# Altium project Stabilizer.PrjPCB (part 1 of 5)
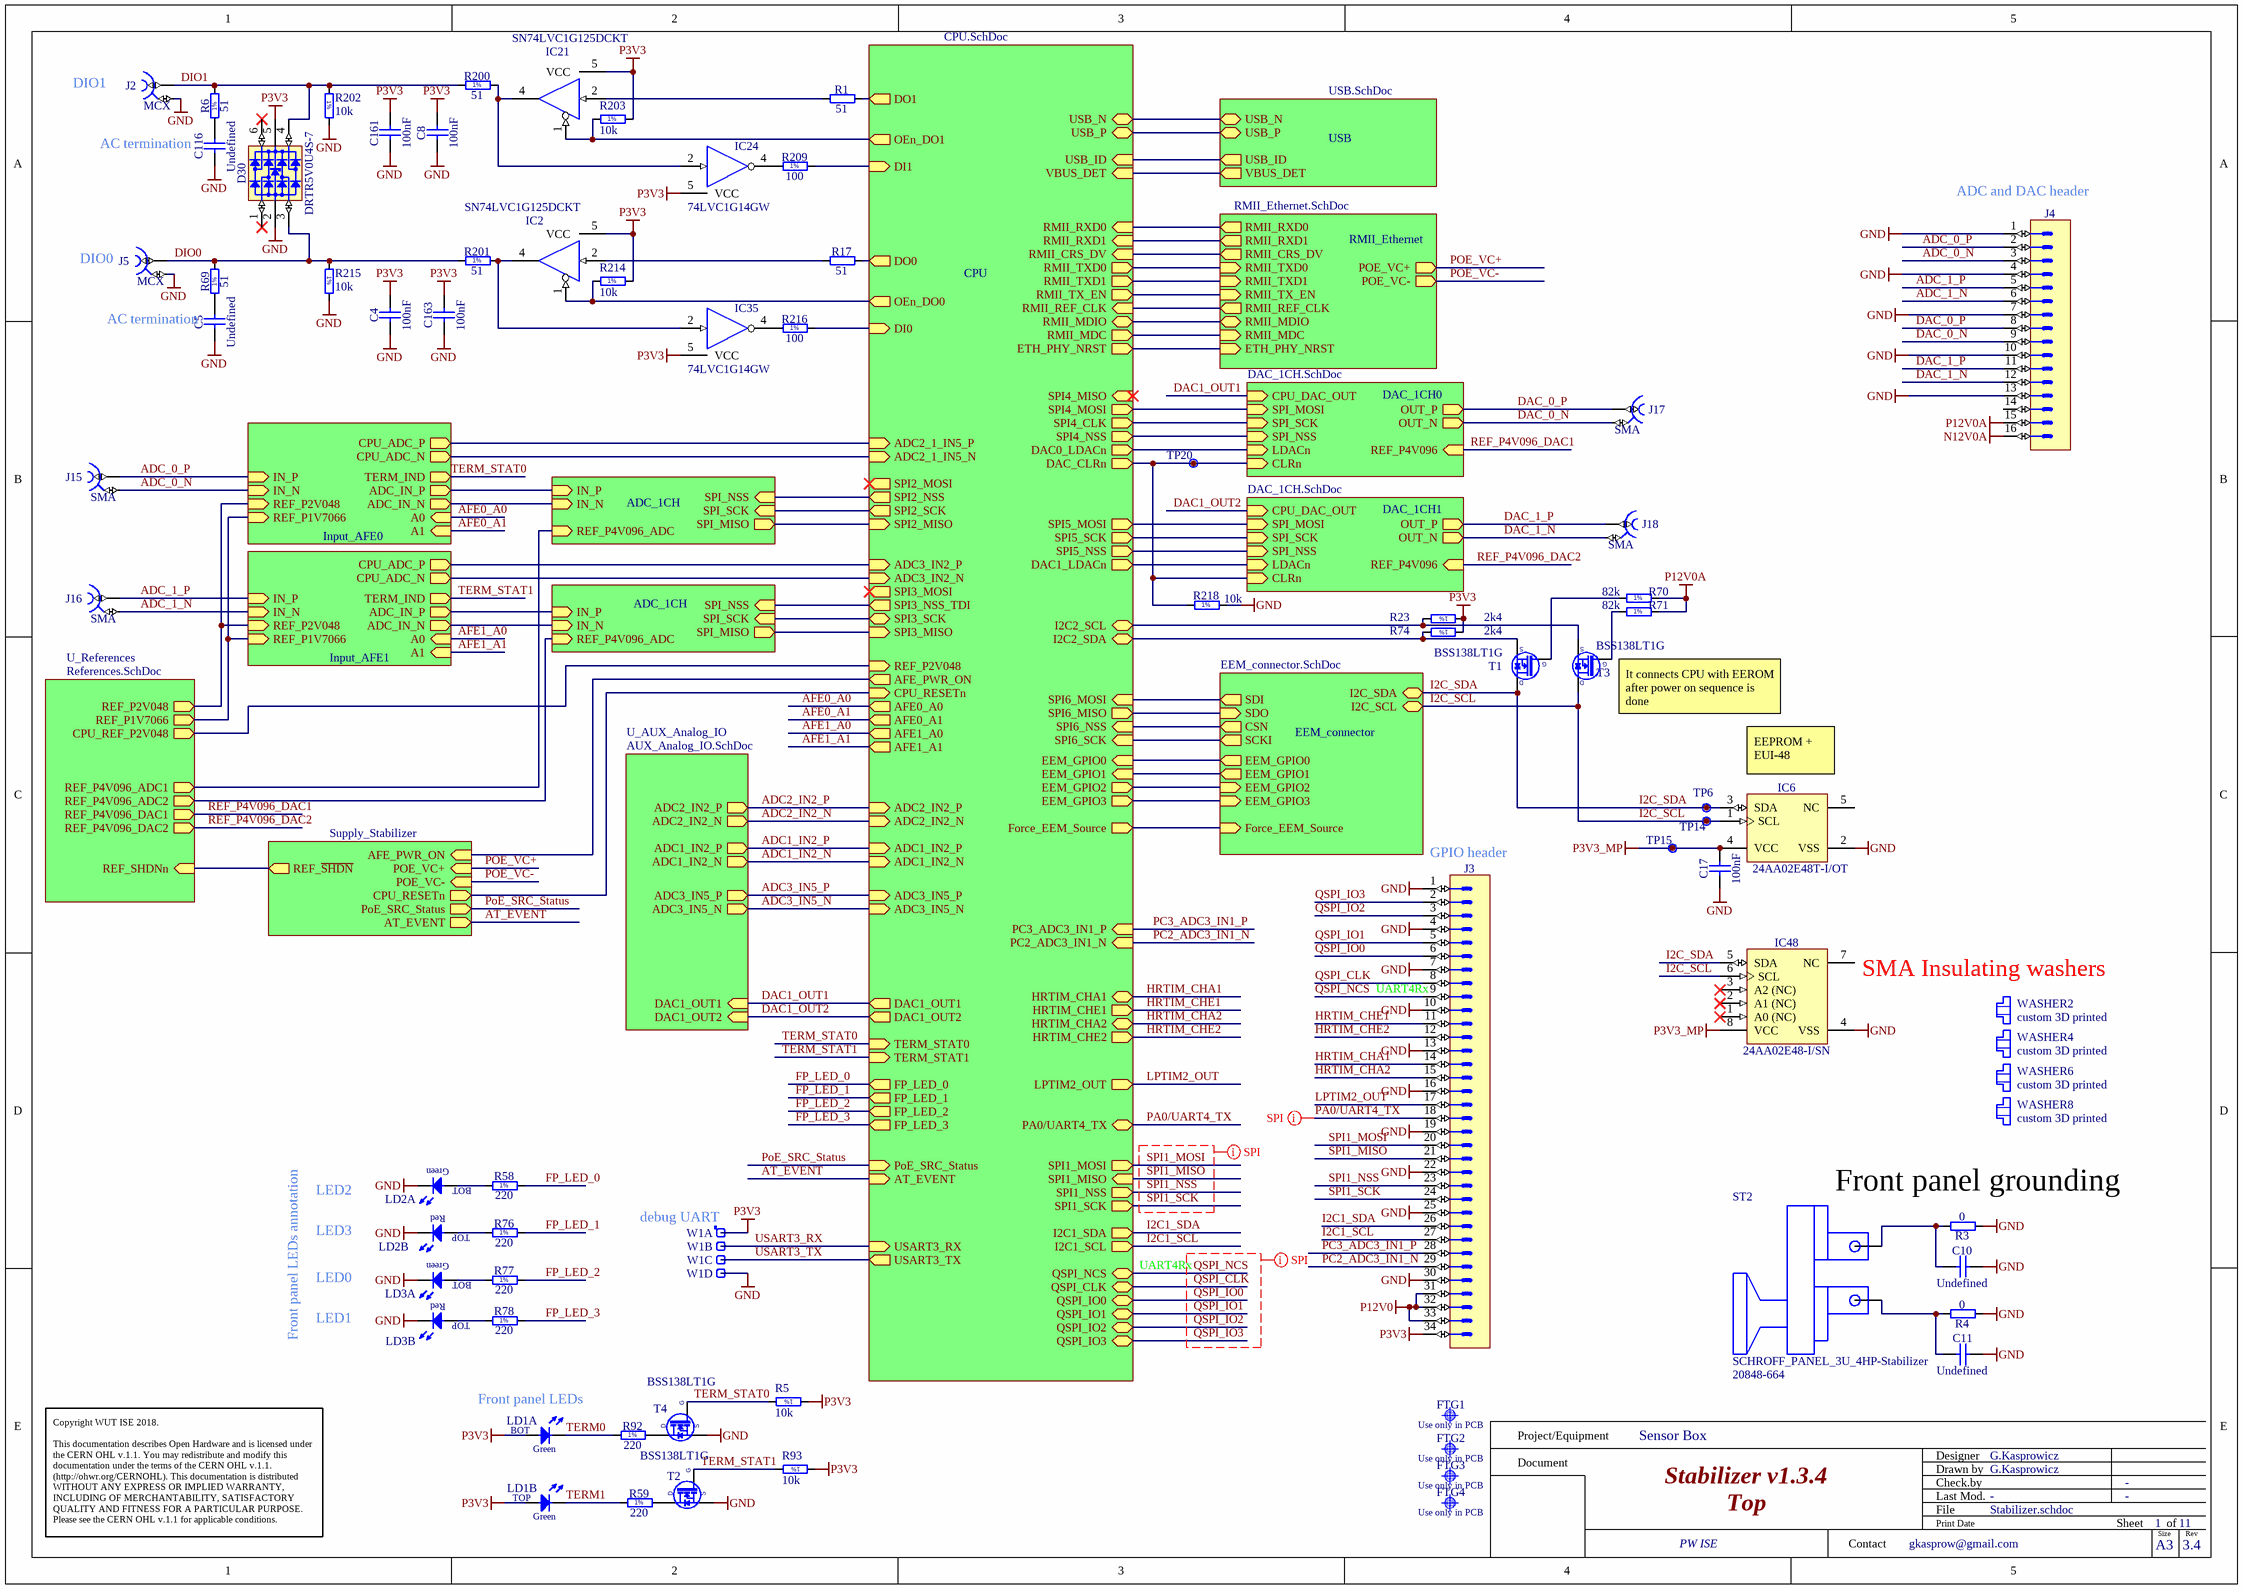
[diagram p0: Stabilizer.schdoc]
P_version: 1.3.4
11 sheets, 687 parts. Net scope: hierarchical (ports join the sheet entries above them; power ports are global).
Board files: Stabilizer.PCBDOC, Panel_Stabilizer.PcbDoc
Sheets:
  Stabilizer.schdoc
    Supply_Stabilizer = Supply_Stabilizer.SchDoc
    RMII_Ethernet = RMII_Ethernet.SchDoc
    USB = USB.SchDoc
    CPU = CPU.SchDoc
    Input_AFE0 = Input_AFE.SchDoc
    ADC_1CH = ADC_1CH.SchDoc
    DAC_1CH0 = DAC_1CH.SchDoc
    ADC_1CH = ADC_1CH.SchDoc
    Input_AFE1 = Input_AFE.SchDoc
    U_References = References.SchDoc
    DAC_1CH1 = DAC_1CH.SchDoc
    EEM_connector = EEM_connector.SchDoc
    U_AUX_Analog_IO = AUX_Analog_IO.SchDoc

## Sheet Stabilizer.schdoc: Stabilizer v1.3.4
size 420 x 297 mm; EDA_Number: ARTIQ; Projet: Stabilizer; Author: G.Kasprowicz; CompanyName: WUT ISE; DrawnBy: G.Kasprowicz; Organization: WUT ISE; Address1: PW ISE; Address2: Nowowiejska 15/19 00-665 Warsaw; Address3: gkasprow@gmail.com; DocumentNumber: 1; Revision: 3.4; SheetNumber: 1; SheetTotal: 11; ModifiedBy: -; CheckedDate: -; Title2: Top; DivGrp: WUT ISE; Designer: G.Kasprowicz; ModifiedDate: -; ProjectName: Sensor Box

### Parts
C4  100nF  [CAPC1005X55N]
C5  Undefined  [CAPC1608X90N]
C8  100nF  [CAPC1005X55N]
C10  Undefined  [CAPC2012X135N]
C11  Undefined  [CAPC2012X135N]
C17  100nF  [CAPC1005X55N]
C116  Undefined  [CAPC1608X90N]
C161  100nF  [CAPC1005X55N]
C163  100nF  [CAPC1005X55N]
D30  DRTR5V0U4S-7  [SOT65P210X110-6N]
FTG1  Use only in PCB  [FIDUCIAL_TOP_C100-200]
FTG2  Use only in PCB  [FIDUCIAL_TOP_S100-200]
FTG3  Use only in PCB  [FIDUCIAL_TOP_S100-200]
FTG4  Use only in PCB  [FIDUCIAL_TOP_S100-200]
IC2  SN74LVC1G125DCKT  [SOT65P210X110-5N]
IC6  24AA02E48T-I/OT  [SOT95P280X145-5N]
IC21  SN74LVC1G125DCKT  [SOT65P210X110-5N]
IC24  74LVC1G14GW  [SOT65P212X110-5N]
IC35  74LVC1G14GW  [SOT65P212X110-5N]
IC48  24AA02E48-I/SN  [SOIC127P600X175-8N]
J2  MCX  [AMPHENOL_919-383J-51A]
J3  Use original!  [3M_N2534-6002RB]  (value not drawn)
J4  Use original!  [3M_N2516-6002RB]  (value not drawn)
J5  MCX  [AMPHENOL_919-383J-51A]
J15  SMA  [DELOCK_65848]
J16  SMA  [DELOCK_65848]
J17  SMA  [DELOCK_65848]
J18  SMA  [DELOCK_65848]
LD1  Green/Green  [LED_DIALIGHT_571-0122F]  (value not drawn)  (parts A,B of 2)
LD2  Red/Green  [LED_DIALIGHT_571-0112F]  (value not drawn)  (parts A,B of 2)
LD3  Red/Green  [LED_DIALIGHT_571-0112F]  (value not drawn)  (parts A,B of 2)
R1  51  [RESC1005X40N]
R3  0  [RESC1608X55N]
R4  0  [RESC1608X55N]
R5  10k  [RESC1005X40N]
R6  51  [RESC1005X40N]
R17  51  [RESC1005X40N]
R23  2k4  [RESC1005X40N]
R58  220  [RESC1608X55N]
R59  220  [RESC1608X55N]
R69  51  [RESC1005X40N]
R70  82k  [RESC1608X55N]
R71  82k  [RESC1608X55N]
R74  2k4  [RESC1005X40N]
R76  220  [RESC1608X55N]
R77  220  [RESC1608X55N]
R78  220  [RESC1608X55N]
R92  220  [RESC1608X55N]
R93  10k  [RESC1005X40N]
R200  51  [RESC1005X40N]
R201  51  [RESC1005X40N]
R202  10k  [RESC1005X40N]
R203  10k  [RESC1005X40N]
R209  100  [RESC1005X40N]
R214  10k  [RESC1005X40N]
R215  10k  [RESC1005X40N]
R216  100  [RESC1005X40N]
R218  10k  [RESC1005X40N]
ST2  SCHROFF_PANEL_3U_4HP-Stabilizer  Manufacturer Part Number 2: 20848-664  [SCHROFF_PANEL_3HP_4U - Stabilizer]
T1  BSS138LT1G  [SOT95P240X110-3N]
T2  BSS138LT1G  [SOT95P240X110-3N]
T3  BSS138LT1G  [SOT95P240X110-3N]
T4  BSS138LT1G  [SOT95P240X110-3N]
TP6  Test Point  [TPS127]  (value not drawn)
TP14  Test Point  [TPS127]  (value not drawn)
TP15  Test Point  [TPS127]  (value not drawn)
TP20  Test Point  [TPS127]  (value not drawn)
W1  Header 4  [SAMTEC_HTSW-104-23-L-S]  (value not drawn)  (parts A,B,C,D of 4)
WASHER2  custom 3D printed  [Keystone_7687]
WASHER4  custom 3D printed  [Keystone_7687]
WASHER6  custom 3D printed  [Keystone_7687]
WASHER8  custom 3D printed  [Keystone_7687]

### Sub-sheets
ADC_1CH = ADC_1CH.SchDoc: IN_P (in), IN_N (in), SPI_NSS (in), SPI_SCK (in), SPI_MISO (out), REF_P4V096_ADC (in)
ADC_1CH = ADC_1CH.SchDoc: IN_P (in), IN_N (in), SPI_NSS (in), SPI_SCK (in), SPI_MISO (out), REF_P4V096_ADC (in)
CPU = CPU.SchDoc: USB_N (bidir), USB_P (bidir), USB_ID (in), RMII_TXD0 (out), RMII_TX_EN (out), RMII_RXD0 (in), RMII_REF_CLK (in), RMII_CRS_DV (in), RMII_MDC (out), RMII_MDIO (bidir), RMII_TXD1 (out), RMII_RXD1 (in), DAC1_OUT1 (out), ADC1_IN2_P (in), I2C2_SDA (bidir), SPI6_MOSI (in), I2C2_SCL (bidir), DAC1_OUT2 (out), ADC3_IN5_N (in), ADC3_IN5_P (in), SPI6_MISO (out), SPI6_NSS (in), ADC1_IN2_N (in), PC3_ADC3_IN1_P (in), PC2_ADC3_IN1_N (in), SPI6_SCK (in), AFE0_A0 (out), AFE0_A1 (out), AFE1_A0 (out), AFE1_A1 (out), DI0 (in), DI1 (in), DAC0_LDACn (out), DAC1_LDACn (out), DAC_CLRn (out), CPU_RESETn (in), EEM_GPIO0 (in), EEM_GPIO1 (in), EEM_GPIO2 (out), EEM_GPIO3 (out), I2C1_SDA (out), I2C1_SCL (out), PA0/UART4_TX (bidir), HRTIM_CHE1 (out), HRTIM_CHA2 (bidir), HRTIM_CHA1 (bidir), LPTIM2_OUT (out), HRTIM_CHE2 (out), TERM_STAT0 (in), TERM_STAT1 (in), REF_P2V048 (in), FP_LED_0 (out), FP_LED_1 (out), FP_LED_2 (out), FP_LED_3 (out), ADC2_1_IN5_P (in), ADC2_1_IN5_N (in), ADC3_IN2_N (in), ADC3_IN2_P (in), ADC2_IN2_P (in), ADC2_IN2_N (in), AT_EVENT (in), ETH_PHY_NRST (out), SPI3_SCK (bidir), SPI3_MOSI (out), SPI3_MISO (in), SPI3_NSS_TDI (out), SPI2_MOSI (out), SPI2_NSS (out), SPI2_SCK (out), SPI2_MISO (in), SPI1_SCK (out), SPI1_NSS (out), SPI1_MISO (in), SPI1_MOSI (out), SPI4_MOSI (out), SPI4_NSS (out), SPI4_CLK (out), SPI4_MISO (in), SPI5_NSS (out), SPI5_SCK (out), SPI5_MOSI (out), QSPI_IO0 (bidir), QSPI_NCS (bidir), QSPI_IO3 (bidir), QSPI_CLK (bidir), QSPI_IO1 (bidir), QSPI_IO2 (bidir), PoE_SRC_Status (in), Force_EEM_Source (out), VBUS_DET (in), DO0 (out), DO1 (out), OEn_DO0 (out), OEn_DO1 (out), USART3_TX (out), USART3_RX (in), AFE_PWR_ON (out)
DAC_1CH0 = DAC_1CH.SchDoc: SPI_NSS (in), SPI_SCK (in), SPI_MOSI (in), OUT_P (out), OUT_N (out), LDACn (in), CLRn (in), REF_P4V096 (in), CPU_DAC_OUT (in)
DAC_1CH1 = DAC_1CH.SchDoc: SPI_NSS (in), SPI_SCK (in), SPI_MOSI (in), OUT_P (out), OUT_N (out), LDACn (in), CLRn (in), REF_P4V096 (in), CPU_DAC_OUT (in)
EEM_connector = EEM_connector.SchDoc: I2C_SDA (bidir), I2C_SCL (bidir), EEM_GPIO0 (out), EEM_GPIO1 (out), EEM_GPIO2 (in), EEM_GPIO3 (in), SCKI (out), SDI (out), CSN (out), SDO (in), Force_EEM_Source (in)
Input_AFE0 = Input_AFE.SchDoc: IN_N (in), A0 (in), A1 (in), IN_P (in), TERM_IND (out), ADC_IN_P (out), ADC_IN_N (out), REF_P2V048 (in), REF_P1V7066 (in), CPU_ADC_N (out), CPU_ADC_P (out)
Input_AFE1 = Input_AFE.SchDoc: IN_N (in), A0 (in), A1 (in), IN_P (in), TERM_IND (out), ADC_IN_P (out), ADC_IN_N (out), REF_P2V048 (in), REF_P1V7066 (in), CPU_ADC_N (out), CPU_ADC_P (out)
RMII_Ethernet = RMII_Ethernet.SchDoc: RMII_TXD0 (in), RMII_TX_EN (in), RMII_RXD0 (out), RMII_REF_CLK (out), RMII_CRS_DV (out), RMII_MDC (in), RMII_MDIO (bidir), ETH_PHY_NRST (in), RMII_TXD1 (in), RMII_RXD1 (out), POE_VC+ (out), POE_VC- (out)
Supply_Stabilizer = Supply_Stabilizer.SchDoc: REF_~{SHDN} (out), POE_VC+ (in), POE_VC- (in), CPU_RESETn (out), AT_EVENT (out), PoE_SRC_Status (out), AFE_PWR_ON (in)
U_AUX_Analog_IO = AUX_Analog_IO.SchDoc: DAC1_OUT1 (in), ADC1_IN2_P (out), DAC1_OUT2 (in), ADC3_IN5_N (out), ADC3_IN5_P (out), ADC1_IN2_N (out), ADC2_IN2_P (out), ADC2_IN2_N (out)
U_References = References.SchDoc: REF_SHDNn (in), REF_P4V096_ADC2 (out), REF_P2V048 (out), REF_P1V7066 (out), REF_P4V096_DAC2 (out), REF_P4V096_DAC1 (out), CPU_REF_P2V048 (out), REF_P4V096_ADC1 (out)
USB = USB.SchDoc: VBUS_DET (out), USB_N (bidir), USB_P (bidir), USB_ID (out)

### Nets
GND: C4.1 C5.1 C8.1 C10.2 C11.2 C17.1 C116.1 C161.1 C163.1 D30.2(GND) IC2.3(GND) IC6.2(VSS) IC21.3(GND) IC24.3(GND) IC35.3(GND) IC48.4(VSS) J2.2 J3.1 J3.4 J3.7 J3.10 J3.13 J3.16 J3.19 J3.22 J3.25 J3.30 J4.1 J4.4 J4.7 J4.10 J4.13 J5.2 LD2.1(C) LD2.3(C) LD3.1(C) LD3.3(C) R3.1 R4.1 R202.2 R215.2 R218.2 T2.2(S) T4.2(S) W1.4
N12V0A: J4.16
P3V3: C4.2 C8.2 C161.2 C163.2 D30.5(VBUS) IC2.5(VCC) IC21.5(VCC) IC24.5(VCC) IC35.5(VCC) J3.34 LD1.2(A) LD1.4(A) R5.1 R23.1 R74.1 R93.1 R203.2 R214.2 W1.1
P3V3_MP: C17.2 IC6.4(VCC) IC48.8(VCC) TP15.1
P12V0: J3.31 J3.32 J3.33
P12V0A: J4.15 R70.2 R71.2
ADC1_IN2_N: sheet CPU/ADC1_IN2_N, sheet U_AUX_Analog_IO/ADC1_IN2_N
ADC1_IN2_P: sheet CPU/ADC1_IN2_P, sheet U_AUX_Analog_IO/ADC1_IN2_P
ADC2_1_IN5_N: sheet CPU/ADC2_1_IN5_N, sheet Input_AFE0/CPU_ADC_N
ADC2_1_IN5_P: sheet CPU/ADC2_1_IN5_P, sheet Input_AFE0/CPU_ADC_P
ADC2_IN2_N: sheet CPU/ADC2_IN2_N, sheet U_AUX_Analog_IO/ADC2_IN2_N
ADC2_IN2_P: sheet CPU/ADC2_IN2_P, sheet U_AUX_Analog_IO/ADC2_IN2_P
ADC3_IN2_N: sheet CPU/ADC3_IN2_N, sheet Input_AFE1/CPU_ADC_N
ADC3_IN2_P: sheet CPU/ADC3_IN2_P, sheet Input_AFE1/CPU_ADC_P
ADC3_IN5_N: sheet CPU/ADC3_IN5_N, sheet U_AUX_Analog_IO/ADC3_IN5_N
ADC3_IN5_P: sheet CPU/ADC3_IN5_P, sheet U_AUX_Analog_IO/ADC3_IN5_P
ADC_0_N: J4.3 J15.2 ; sheet Input_AFE0/IN_N
ADC_0_P: J4.2 J15.1 ; sheet Input_AFE0/IN_P
ADC_1_N: J4.6 J16.2 ; sheet Input_AFE1/IN_N
ADC_1_P: J4.5 J16.1 ; sheet Input_AFE1/IN_P
AFE0_A0: sheet CPU/AFE0_A0, sheet Input_AFE0/A0
AFE0_A1: sheet CPU/AFE0_A1, sheet Input_AFE0/A1
AFE1_A0: sheet CPU/AFE1_A0, sheet Input_AFE1/A0
AFE1_A1: sheet CPU/AFE1_A1, sheet Input_AFE1/A1
AFE_PWR_ON: sheet Supply_Stabilizer/AFE_PWR_ON, sheet CPU/AFE_PWR_ON
AT_EVENT: sheet Supply_Stabilizer/AT_EVENT, sheet CPU/AT_EVENT
CLRn: R218.1 TP20.1 ; sheet CPU/DAC_CLRn, sheet DAC_1CH0/CLRn, sheet DAC_1CH1/CLRn
CPU_REF_P2V048: sheet CPU/REF_P2V048, sheet U_References/CPU_REF_P2V048
CPU_RESETn: sheet Supply_Stabilizer/CPU_RESETn, sheet CPU/CPU_RESETn
CSN: sheet CPU/SPI6_NSS, sheet EEM_connector/CSN
DAC0_LDACn: sheet CPU/DAC0_LDACn, sheet DAC_1CH0/LDACn
DAC1_LDACn: sheet CPU/DAC1_LDACn, sheet DAC_1CH1/LDACn
DAC1_OUT1: sheet CPU/DAC1_OUT1, sheet DAC_1CH0/CPU_DAC_OUT, sheet U_AUX_Analog_IO/DAC1_OUT1
DAC1_OUT2: sheet CPU/DAC1_OUT2, sheet DAC_1CH1/CPU_DAC_OUT, sheet U_AUX_Analog_IO/DAC1_OUT2
DAC_0_N: J4.9 J17.2 ; sheet DAC_1CH0/OUT_N
DAC_0_P: J4.8 J17.1 ; sheet DAC_1CH0/OUT_P
DAC_1_N: J4.12 J18.2 ; sheet DAC_1CH1/OUT_N
DAC_1_P: J4.11 J18.1 ; sheet DAC_1CH1/OUT_P
DI0: R216.2 ; sheet CPU/DI0
DI1: R209.2 ; sheet CPU/DI1
DIO0: D30.3(I/O2) J5.1 R69.2 R201.1 R215.1
DIO1: D30.4(I/O3) J2.1 R6.2 R200.1 R202.1
DO0: R17.2 ; sheet CPU/DO0
DO1: R1.2 ; sheet CPU/DO1
EEM_GPIO0: sheet CPU/EEM_GPIO0, sheet EEM_connector/EEM_GPIO0
EEM_GPIO1: sheet CPU/EEM_GPIO1, sheet EEM_connector/EEM_GPIO1
EEM_GPIO2: sheet CPU/EEM_GPIO2, sheet EEM_connector/EEM_GPIO2
EEM_GPIO3: sheet CPU/EEM_GPIO3, sheet EEM_connector/EEM_GPIO3
ETH_PHY_NRST: sheet RMII_Ethernet/ETH_PHY_NRST, sheet CPU/ETH_PHY_NRST
Force_EEM_Source: sheet CPU/Force_EEM_Source, sheet EEM_connector/Force_EEM_Source
FP_LED_0: R58.2 ; sheet CPU/FP_LED_0
FP_LED_1: R76.2 ; sheet CPU/FP_LED_1
FP_LED_2: R77.2 ; sheet CPU/FP_LED_2
FP_LED_3: R78.2 ; sheet CPU/FP_LED_3
HRTIM_CHA1: J3.14 ; sheet CPU/HRTIM_CHA1
HRTIM_CHA2: J3.15 ; sheet CPU/HRTIM_CHA2
HRTIM_CHE1: J3.11 ; sheet CPU/HRTIM_CHE1
HRTIM_CHE2: J3.12 ; sheet CPU/HRTIM_CHE2
I2C1_SCL: J3.27 ; sheet CPU/I2C1_SCL
I2C1_SDA: J3.26 ; sheet CPU/I2C1_SDA
I2C2_SCL: R23.2 T3.2(S) ; sheet CPU/I2C2_SCL
I2C2_SDA: R74.2 T1.2(S) ; sheet CPU/I2C2_SDA
I2C_SCL: IC6.1(SCL) IC48.6(SCL) T3.3(D) TP14.1 ; sheet EEM_connector/I2C_SCL
I2C_SDA: IC6.3(SDA) IC48.5(SDA) T1.3(D) TP6.1 ; sheet EEM_connector/I2C_SDA
IN_N: sheet Input_AFE0/ADC_IN_N, sheet ADC_1CH/IN_N
IN_N: sheet ADC_1CH/IN_N, sheet Input_AFE1/ADC_IN_N  [a separate net that carries the same name]
IN_P: sheet Input_AFE0/ADC_IN_P, sheet ADC_1CH/IN_P
IN_P: sheet ADC_1CH/IN_P, sheet Input_AFE1/ADC_IN_P  [a separate net that carries the same name]
LPTIM2_OUT: J3.17 ; sheet CPU/LPTIM2_OUT
OEn_DO0: IC2.1(~{G}) R214.1 ; sheet CPU/OEn_DO0
OEn_DO1: IC21.1(~{G}) R203.1 ; sheet CPU/OEn_DO1
PA0/UART4_TX: J3.18 ; sheet CPU/PA0/UART4_TX
PC2_ADC3_IN1_N: J3.29 ; sheet CPU/PC2_ADC3_IN1_N
PC3_ADC3_IN1_P: J3.28 ; sheet CPU/PC3_ADC3_IN1_P
PoE_SRC_Status: sheet Supply_Stabilizer/PoE_SRC_Status, sheet CPU/PoE_SRC_Status
POE_VC+: sheet Supply_Stabilizer/POE_VC+, sheet RMII_Ethernet/POE_VC+
POE_VC-: sheet Supply_Stabilizer/POE_VC-, sheet RMII_Ethernet/POE_VC-
QSPI_CLK: J3.8 ; sheet CPU/QSPI_CLK
QSPI_IO0: J3.6 ; sheet CPU/QSPI_IO0
QSPI_IO1: J3.5 ; sheet CPU/QSPI_IO1
QSPI_IO2: J3.3 ; sheet CPU/QSPI_IO2
QSPI_IO3: J3.2 ; sheet CPU/QSPI_IO3
QSPI_NCS: J3.9 ; sheet CPU/QSPI_NCS
REF_P1V7066: sheet Input_AFE0/REF_P1V7066, sheet Input_AFE1/REF_P1V7066, sheet U_References/REF_P1V7066
REF_P2V048: sheet Input_AFE0/REF_P2V048, sheet Input_AFE1/REF_P2V048, sheet U_References/REF_P2V048
REF_P4V096_ADC: sheet ADC_1CH/REF_P4V096_ADC, sheet U_References/REF_P4V096_ADC2
REF_P4V096_ADC: sheet ADC_1CH/REF_P4V096_ADC, sheet U_References/REF_P4V096_ADC1  [a separate net that carries the same name]
REF_P4V096_DAC1: sheet DAC_1CH0/REF_P4V096, sheet U_References/REF_P4V096_DAC1
REF_P4V096_DAC2: sheet U_References/REF_P4V096_DAC2, sheet DAC_1CH1/REF_P4V096
REF_~{SHDN}: sheet Supply_Stabilizer/REF_~{SHDN}, sheet U_References/REF_SHDNn
RMII_CRS_DV: sheet RMII_Ethernet/RMII_CRS_DV, sheet CPU/RMII_CRS_DV
RMII_MDC: sheet RMII_Ethernet/RMII_MDC, sheet CPU/RMII_MDC
RMII_MDIO: sheet RMII_Ethernet/RMII_MDIO, sheet CPU/RMII_MDIO
RMII_REF_CLK: sheet RMII_Ethernet/RMII_REF_CLK, sheet CPU/RMII_REF_CLK
RMII_RXD0: sheet RMII_Ethernet/RMII_RXD0, sheet CPU/RMII_RXD0
RMII_RXD1: sheet RMII_Ethernet/RMII_RXD1, sheet CPU/RMII_RXD1
RMII_TX_EN: sheet RMII_Ethernet/RMII_TX_EN, sheet CPU/RMII_TX_EN
RMII_TXD0: sheet RMII_Ethernet/RMII_TXD0, sheet CPU/RMII_TXD0
RMII_TXD1: sheet RMII_Ethernet/RMII_TXD1, sheet CPU/RMII_TXD1
SCKI: sheet CPU/SPI6_SCK, sheet EEM_connector/SCKI
SDI: sheet CPU/SPI6_MOSI, sheet EEM_connector/SDI
SDO: sheet CPU/SPI6_MISO, sheet EEM_connector/SDO
SPI1_MISO: J3.21 ; sheet CPU/SPI1_MISO
SPI1_MOSI: J3.20 ; sheet CPU/SPI1_MOSI
SPI1_NSS: J3.23 ; sheet CPU/SPI1_NSS
SPI1_SCK: J3.24 ; sheet CPU/SPI1_SCK
SPI2_MISO: sheet CPU/SPI2_MISO, sheet ADC_1CH/SPI_MISO
SPI2_NSS: sheet CPU/SPI2_NSS, sheet ADC_1CH/SPI_NSS
SPI2_SCK: sheet CPU/SPI2_SCK, sheet ADC_1CH/SPI_SCK
SPI3_MISO: sheet CPU/SPI3_MISO, sheet ADC_1CH/SPI_MISO
SPI3_SCK: sheet CPU/SPI3_SCK, sheet ADC_1CH/SPI_SCK
SPI4_MOSI: sheet CPU/SPI4_MOSI, sheet DAC_1CH0/SPI_MOSI
SPI4_NSS: sheet CPU/SPI4_NSS, sheet DAC_1CH0/SPI_NSS
SPI4_SCK: sheet CPU/SPI4_CLK, sheet DAC_1CH0/SPI_SCK
SPI5_MOSI: sheet CPU/SPI5_MOSI, sheet DAC_1CH1/SPI_MOSI
SPI5_NSS: sheet CPU/SPI5_NSS, sheet DAC_1CH1/SPI_NSS
SPI5_SCK: sheet CPU/SPI5_SCK, sheet DAC_1CH1/SPI_SCK
TDI: sheet CPU/SPI3_NSS_TDI, sheet ADC_1CH/SPI_NSS
TERM0: LD1.1(C) R92.1
TERM1: LD1.3(C) R59.1
TERM_STAT0: R5.2 T4.1(G) ; sheet CPU/TERM_STAT0, sheet Input_AFE0/TERM_IND
TERM_STAT1: R93.2 T2.1(G) ; sheet CPU/TERM_STAT1, sheet Input_AFE1/TERM_IND
USART3_RX: W1.2 ; sheet CPU/USART3_RX
USART3_TX: W1.3 ; sheet CPU/USART3_TX
USB_ID: sheet USB/USB_ID, sheet CPU/USB_ID
USB_N: sheet USB/USB_N, sheet CPU/USB_N
USB_P: sheet USB/USB_P, sheet CPU/USB_P
VBUS_DET: sheet USB/VBUS_DET, sheet CPU/VBUS_DET
NetC5_2: C5.2 R69.1
NetC10_1: C10.1 R3.2 ST2.1
NetC11_1: C11.1 R4.2 ST2.0
NetC116_2: C116.2 R6.1
NetIC2_2: IC2.2(IN) R17.1
NetIC2_4: IC2.4(OUT) IC35.2(IN) R201.2
NetIC21_2: IC21.2(IN) R1.1
NetIC21_4: IC21.4(OUT) IC24.2(IN) R200.2
NetIC24_4: IC24.4(OUT) R209.1
NetIC35_4: IC35.4(OUT) R216.1
NetLD2_2: LD2.2(A) R58.1
NetLD2_4: LD2.4(A) R76.1
NetLD3_2: LD3.2(A) R77.1
NetLD3_4: LD3.4(A) R78.1
NetR59_2: R59.2 T2.3(D)
NetR70_1: R70.1 T1.1(G)
NetR71_1: R71.1 T3.1(G)
NetR92_2: R92.2 T4.3(D)

Not connected (* = marked no-connect by the designer): D30 1(I/O1)* 6(I/O4)*; IC6 5(NC); IC48 1(A0_(NC))* 2(A1_(NC))* 3(A2_(NC))* 7(NC); J4 14

### Layout directives
net class SPI: PA0/UART4_TX, QSPI_CLK, QSPI_IO0, QSPI_IO1, QSPI_IO2, QSPI_IO3, QSPI_NCS, SPI1_MISO, SPI1_MOSI, SPI1_NSS, SPI1_SCK

### Notes on the sheet
- (near J2) DIO1
- AC termination
- (near J5) DIO0
- (near J4) ADC and DAC header
- (near C5) AC termination
- (near T3) It connects CPU with EEROM after power on sequence is done
- EEPROM + EUI-48
- (near J3) GPIO header
- (near J3) UART4Rx
- SMA Insulating washers
- LED2
- (near R3) Front panel grounding
- LED3
- (near W1) debug UART
- UART4Rx
- Front panel LEDs annotation
- LED0
- LED1
- Front panel LEDs
- Project/Equipment
- Document
- Designer
- Drawn by
- Check.by
- Copyright WUT ISE 2018.
  This documentation describes Open Hardware and is licensed under the CERN OHL v.1.1. You may redistribute and modify this documentation under the terms of the CERN OHL v.1.1. (http://ohwr.org/CERNOHL). This documentation is distributed WITHOUT ANY EXPRESS OR IMPLIED WARRANTY, INCLUDING OF MERCHANTABILITY, SATISFACTORY QUALITY AND FITNESS FOR A PARTICULAR PURPOSE. Please see the CERN OHL v.1.1 for applicable conditions.
- Contact
- File
- Last Mod.
- Print Date
- Sheet
- Size
- A3
- of
- Rev
- (in symbol LED_DIALIGHT_571-0112F, part A) Green; BOT
- (in symbol LED_DIALIGHT_571-0112F, part B) Red; TOP
- (in symbol LED_DIALIGHT_571-0122F, part A) BOT; Green
- (in symbol LED_DIALIGHT_571-0122F, part B) TOP; Green
- (in symbol R0402_2K4_1%_0.0625W_100PPM) 1%
- (in symbol R0402_10K_1%_0.0625W_100PPM) 1%
- (in symbol R0402_51R_1%_0.0625W_100PPM) 1%
- (in symbol R0402_100R_1%_0.0625W_100PPM) 1%
- (in symbol R0603_82K_1%_0.1W_100PPM) 1%
- (in symbol R0603_220R_1%_0.1W_100PPM) 1%

### Library data of the parts
C4 C8 C161 C163 = CC0402_100NF_16V_10%_X7R: Non-polarised capacitor; Part Description: SMD Multilayer Chip Ceramic Capacitor; Manufacturer: GENERIC; Manufacturer1 Part Number: GRM155R71C104KA88D; Voltage: 16V; TC: X7R; Tolerance: ±10%; Part Number: CC0402_100NF_16V_10%_X7R; Component Kind: Standard; Component Type: Standard; Pin Count: 2; Value: 100nF; Status: Not Recommended; Manufacturer Part Number: CC0402_100NF_16V_10%_X7R; Case: 0402; Mounted: Yes; Socket: No; SMD: Yes; Sense: No; Manufacturer1 Example: MURATA; Manufacturer1 ComponentHeight: 0.55mm; HelpURL: \\cern.ch\dfs\Applications\Altium\Datasheets\CC0402_X7R_MURATA_GRM.pdf; Author: CERN DEM JLC; CreateDate: 05.12.2013; LatestRevisionDate: 03.12.2007
C5 C116 = CC0603_NO-VALUE: Non-polarised capacitor; Part Description: Reserved Footprint For 0603(1608) Chip Ceramic Capacitor; Mounted: No; Part Number: CC0603_NO-VALUE; Component Kind: Standard; Component Type: Standard; Pin Count: 2; Value: Undefined; Status: None; Manufacturer: Undefined; Manufacturer Part Number: CC0603_NO-VALUE; Case: 0603; Socket: No; SMD: Yes; Sense: No; Manufacturer1 ComponentHeight: 0.9mm; HelpURL: Undefined; Author: CERN DEM MR; CreateDate: 22.11.2016; LatestRevisionDate: 22.11.2016
C10 C11 = CC0805_NO-VALUE: Non-polarised capacitor; Part Description: Reserved Footprint For 0805(2012) Chip Ceramic Capacitor; Mounted: No; Part Number: CC0805_NO-VALUE; Component Kind: Standard; Component Type: Standard; Pin Count: 2; Value: Undefined; Status: None; Manufacturer: Undefined; Manufacturer Part Number: CC0805_NO-VALUE; Case: 0805; Socket: No; SMD: Yes; Sense: No; Manufacturer1 ComponentHeight: 1.35mm; HelpURL: Undefined; Author: CERN DEM JLC; CreateDate: 10.12.2008; LatestRevisionDate: 11.09.2013
C17 = CC0402_100NF_16V_10%_X5R: Non-polarised capacitor; Part Description: SMD Multilayer Chip Ceramic Capacitor; Manufacturer: GENERIC; Manufacturer1 Part Number: GRM155R61C104KA88D; Voltage: 16V; TC: X5R; Tolerance: ±10%; Part Number: CC0402_100NF_16V_10%_X5R; Component Kind: Standard; Component Type: Standard; Pin Count: 2; Value: 100nF; Status: None; Manufacturer Part Number: CC0402_100NF_16V_10%_X5R; Case: 0402; Mounted: Yes; Socket: No; SMD: Yes; Sense: No; Manufacturer1 Example: MURATA; Manufacturer1 ComponentHeight: 0.55mm; HelpURL: \\cern.ch\dfs\Applications\Altium\Datasheets\CC0402_X5R_MURATA_GRM.pdf; Author: CERN DEM JLC; CreateDate: 10.12.2013; LatestRevisionDate: 10.12.2013
D30 = D_TVS_DRTR5V0U4S-7: Integrated Quad Ultra-Low Capacitance ESD Protection; Part Description: Integrated Quad Ultra-Low Capacitance ESD (±8kV) Protection; Manufacturer: DIODES; PressFit: No; Bonding: No; Status Comment: Active; Part Number: DRTR5V0U4S-7; Component Kind: Standard; Component Type: Standard; Device: DRTR5V0U4S-7; PackageDescription: SOT363, SC70-6, 0.65mm Pitch; 6 Pin, 1.25mm W X 2.00mm L X 1.10mm H body, IPC Medium Density; Status: Active; Manufacturer Part Number: DRTR5V0U4S-7; Pin Count: 6; Case: SOT363; Mounted: Yes; Socket: No; SMD: Yes; Sense: No; ComponentHeight: 1.1mm; HelpURL: \\cern.ch\dfs\Applications\Altium\Datasheets\PRTR5V0U4Y.pdf; Author: GK; CreateDate: 24.01.2017; LatestRevisionDate: 14.09.2020
FTG1 = FIDUCIAL_TARGET_C100-200: Fiducial Target; Part Description: Round Fiducial Target, Top Layer, 1.0mm, Top Solder 2.0mm, Keepout =2.0mm; Mounted: No; Part Number: FIDUCIAL_TARGET_C100-200; Component Kind: Standard (No BOM); Component Type: Standard (No BOM); Pin Count: 1; Family: Fiducial; Socket: No; SMD: Yes; Sense: No; Status: None; ComponentHeight: 0mm; HelpURL: Undefined; Author: CERN DEM JLC; CreateDate: 09.02.2010; LatestRevisionDate: 04.04.2012; PackageDescription: Round Fiducial Target, Top Layer, 1.0mm, Top Solder 2.0mm, Keepout =2.0mm
FTG2-FTG4 = FIDUCIAL_TARGET_S100-200: Fiducial Target; Part Description: Square Fiducial Target, Top Layer, 1.0mm, Top Solder 2.0mm, Keepout =2.0mm; Mounted: No; Part Number: FIDUCIAL_TARGET_S100-200; Component Kind: Standard (No BOM); Component Type: Standard (No BOM); Pin Count: 1; Family: Fiducial; Socket: No; SMD: Yes; Sense: No; Status: None; ComponentHeight: 0mm; HelpURL: Undefined; Author: CERN DEM JLC; CreateDate: 09.02.2010; LatestRevisionDate: 04.04.2012; PackageDescription: Square Fiducial Target, Top Layer, 1.0mm, Top Solder 2.0mm, Keepout =2.0mm
IC2 IC21 = SN74LVC1G125DCKT: Single Bus Buffer Gate With 3-State Output; Part Description: Single Bus Buffer Gate With 3-State Outputs; Manufacturer: TEXAS INSTRUMENTS; PressFit: No; Bonding: No; Part Number: SN74LVC1G125DCKT; Component Kind: Standard; Component Type: Standard; Device: SN74LVC1G125DCKT; PackageDescription: SOT353, SC70-5, SOT, 0.65mm Pitch, 5 pin, 1.25mm W X 2.00mm L X 1.10mm H, IPC Medium Density; Manufacturer Part Number: SN74LVC1G125DCKT; Pin Count: 5; Case: SOT353; Mounted: Yes; Socket: No; SMD: Yes; Sense: No; ComponentHeight: 1.1mm; Author: CERN DEM JLC; HelpURL: \\cern.ch\dfs\Applications\Altium\Datasheets\SN74LVC1G125DCKT.pdf; CreateDate: 19.12.2011; LatestRevisionDate: 19.12.2011
IC6 = 24AA02E48T-I/OT: 1.7V-5.5V, 2K I2C Serial EEPROM With EUI-48 Node Identity; Manufacturer: MICROCHIP TECHNOLOGY; PressFit: No; Bonding: No; Part Number: 24AA02E48T-I/OT; Component Kind: Standard; Component Type: Standard; Device: 24AA02E48T-I/OT; PackageDescription: SOT, 0.95mm pitch; 5 pin, 1.60mm W X 2.90mm L X 1.45mm H body, IPC Medium Density; Part Description: 1.7V-5.5V, 2K I2C Serial EEPROM With EUI-48 Node Identity; Manufacturer Part Number: 24AA02E48T-I/OT; Pin Count: 5; Case: SOT23-5; Mounted: Yes; Socket: No; SMD: Yes; Sense: No; ComponentHeight: 1.45mm; HelpURL: \\cern.ch\dfs\Applications\Altium\Datasheets\24AA02E48T-I-OT.pdf; Author: CERN DEM MR; CreateDate: 31.03.2016; LatestRevisionDate: 31.03.2016
IC24 IC35 = 74LVC1G14GW: Single Schmitt-Trigger Inverter; Manufacturer: NXP SEMICONDUCTORS; PressFit: No; Bonding: No; Part Number: 74LVC1G14GW; Component Kind: Standard; Component Type: Standard; Device: 74LVC1G14GW; PackageDescription: SOT353, SC70-5, 0.65mm Pitch; 5 Pin, 1.25mm W X 2.05mm L X 1.10mm H body, IPC Medium Density; Part Description: Single Schmitt-trigger inverter; Manufacturer Part Number: 74LVC1G14GW; Pin Count: 4; Case: SOT353; Mounted: Yes; Socket: No; SMD: Yes; Sense: No; ComponentHeight: 1.1mm; Author: CERN DEM JLC; HelpURL: \\cern.ch\dfs\Applications\Altium\Datasheets\74LVC1G14GW.pdf; CreateDate: 04.07.2012; LatestRevisionDate: 04.07.2012
IC48 = MEM_24AA02E48-I/SN: 1.7V-5.5V, 2K I2C™ Serial EEPROMs with EUI-48™ Node Identity; Manufacturer: MICROCHIP TECHNOLOGY; PressFit: No; Bonding: No; Part Number: 24AA02E48-I/SN; Component Kind: Standard; Component Type: Standard; Device: 24AA02E48-I/SN; PackageDescription: SOIC, 1.27mm Pitch; 8 Pin - Body 4x5mm, IPC Medium Density; Part Description: 1.7V-5.5V, 2K I2C™ Serial EEPROMs with EUI-48™ Node Identity; Manufacturer Part Number: 24AA02E48-I/SN; Pin Count: 8; Case: SOIC8; Mounted: Yes; Socket: No; SMD: Yes; Sense: No; ComponentHeight: 1.75mm; HelpURL: \\cern.ch\dfs\Applications\Altium\Datasheets\24AA025E48-I-SN.pdf; Author: CERN DEM MR; CreateDate: 19.07.2016; LatestRevisionDate: 19.07.2016
J2 J5 = AMPHENOL_919-383J-51A: Part Description: 50 Ohm, RF Connector, MCX Right Angle PCB Receptacle Jack; PressFit: No; Part Number: AMPHENOL_919-383J-51A; Component Kind: Standard; Component Type: Standard; Pin Count: 5; Family: MCX; Mounted: Yes; Socket: No; SMD: No; Sense: No; Status: None; Manufacturer: AMPHENOL; Manufacturer Part Number: 919-383J-51A; ComponentHeight: 6mm; HelpURL: \\cern.ch\dfs\Applications\Altium\Datasheets\AMPHENOL_919-383J-51A.pdf; Author: CERN DEM BC; CreateDate: 31.01.2019; LatestRevisionDate: 31.01.2019
J3 = 3M_N2534-6002RB: Connector 34 Male; Part Number: Use original!  3M_N2534-6002RB; Part Description: 34 Contacts - Straight .100'' x .100'' Low Profile Four-Wall Header, 2500 Series; Manufacturer: 3M; Manufacturer Part Number: Use original!  N2534-6002RB; PressFit: No; Component Kind: Standard; Component Type: Standard; Pin Count: 34; Family: Header 34; Mounted: Yes; Socket: No; SMD: No; Sense: No; Status: None; ComponentHeight: 10.03mm; HelpURL: \\cern.ch\dfs\Applications\Altium\Datasheets\3M_N2534-6002RB.pdf; Author: CERN DEM JLC; CreateDate: 11.02.2009; LatestRevisionDate: 11.08.2009
J4 = 3M_N2516-6002RB: Connector 16 Male; Part Number: Use original!  3M_N2516-6002RB; Part Description: 16 Contacts - Straight .100'' x .100'' Low Profile Four-Wall Header, 2500 Series; Manufacturer: 3M; Manufacturer Part Number: Use original! N2516-6002RB; PressFit: No; Component Kind: Standard; Component Type: Standard; Pin Count: 16; Family: Header 16; Mounted: Yes; Socket: No; SMD: No; Sense: No; Status: None; ComponentHeight: 10.03mm; HelpURL: \\cern.ch\dfs\Applications\Altium\Datasheets\3M_N2516-6002RB.pdf; Author: CERN DEM JLC; CreateDate: 11.02.2009; LatestRevisionDate: 11.08.2009
J15-J18 = CON_SMA_DELOCK_65848: 50 Ohm Through Hole SMA Right Angle PCB Jack; Manufacturer: DELOCK; Manufacturer Part Number: 5848 (4043619658480); PressFit: No; Part Number: DELOCK_65848; Component Kind: Standard; Component Type: Standard; Pin Count: 5; Family: SMA; Mounted: Yes; Socket: No; SMD: No; Sense: No; Status: None; Part Description: 50 Ohm Through Hole SMA Right Angle PCB Jack; ComponentHeight: 12.5; HelpURL: \\cern.ch\dfs\Applications\Altium\Datasheets\AMPHENOL_132203-16.pdf; Author: GK; CreateDate: 13.05.2019; LatestRevisionDate: 13.05.2019
LD1 = LED_DIALIGHT_571-0122F: LED x2 Green 1C2A-BOT_3C4A-TOP; Part Description: Dual 2mm Green LEDs CBI® Circuit Board Indicator (Without positioning pins); PressFit: No; Bonding: No; Part Number: LED_DIALIGHT_571-0122F; Component Kind: Standard; Component Type: Standard; Color: Green/Green; PackageDescription: 2x 2mm Red LED PCB Edge Mounting (Without positioning pins) DIALIGHT 571 Serie; Manufacturer: DIALIGHT; Manufacturer Part Number: 571-0122F; Pin Count: 4; Mounted: Yes; Socket: No; SMD: No; Sense: No; ComponentHeight: 8.6mm; HelpURL: \\cern.ch\dfs\Applications\Altium\Datasheets\LED_DIALIGHT_571-0122F.pdf; Author: CERN DEM JLC; CreateDate: 09.11.2009; LatestRevisionDate: 17.03.2010
LD2 LD3 = LED_DIALIGHT_571-0112F: 2x LED  Botom Green, Top Red; Part Description: Dual 2mm  LEDs, Red Top,Green Bot, CBI® Circuit Board Indicator (Without positioning pins); PressFit: No; Bonding: No; Part Number: LED_DIALIGHT_571-0112F; Component Kind: Standard; Component Type: Standard; Color: Red/Green; PackageDescription: 2x 2mm LED (Top: Red, Bot: Green) PCB Edge Mounting (Without positioning pins) DIALIGHT 571 Serie; Manufacturer: DIALIGHT; Manufacturer Part Number: 571-0112F; Pin Count: 4; Mounted: Yes; Socket: No; SMD: No; Sense: No; ComponentHeight: 8.6mm; HelpURL: \\cern.ch\dfs\Applications\Altium\Datasheets\LED_DIALIGHT_571-0112F.pdf; Author: CERN DEM JLC; CreateDate: 09/11/2009; LatestRevisionDate: 17/03/2010
R1 R6 R17 R69 R200 R201 = R0402_51R_1%_0.0625W_100PPM: Resistor - 1%; Part Description: General Purpose Thick Film Chip Resistor; Manufacturer: GENERIC; Manufacturer1 Part Number: 232270675109L; TC: ±100ppm/°C; PressFit: No; Part Number: R0402_51R_1%_0.0625W_100PPM; Component Kind: Standard; Component Type: Standard; Pin Count: 2; Value: 51; Status: Not Recommended; Power: 0.0625W; Tolerance: ±1%; Manufacturer Part Number: R0402_51R_1%_0.0625W_100PPM; Case: 0402; Mounted: Yes; Sense: No; Socket: No; SMD: Yes; Manufacturer1 Example: YAGEO PHYCOMP; Manufacturer1 ComponentHeight: 0.4mm; HelpURL: \\cern.ch\dfs\Applications\Altium\Datasheets\R0402_Phycomp_RC0402.pdf; Author: CERN DEM JLC
  R1 R17: CreateDate: 03.12.2007; LatestRevisionDate: 17.10.2012
  R6 R69 R200 R201: CreateDate: 03/12/2007; LatestRevisionDate: 17/10/2012
R3 R4 = R0603_0R_JUMPER: Resistor; Part Description: 1A (0.05R Max DC Resistance) Zero Ohm Jumper; Manufacturer: GENERIC; Manufacturer1 Part Number: NRC06Z0; PressFit: No; Part Number: R0603_0R_JUMPER; Component Kind: Standard; Component Type: Standard; Pin Count: 2; Value: 0; Status: Preferred; Manufacturer Part Number: R0603_0R_JUMPER; Case: 0603; Mounted: Yes; Sense: No; Socket: No; SMD: Yes; Manufacturer1 Example: NIC COMPONENT; Manufacturer1 ComponentHeight: 0.55mm; HelpURL: \\cern.ch\dfs\Applications\Altium\Datasheets\R0603_NIC_NRC.pdf; Author: CERN DEM JLC; CreateDate: 03.12.2007; LatestRevisionDate: 13.03.2008
R5 R93 R202 R203 R214 R215 = R0402_10K_1%_0.0625W_100PPM: Resistor - 1%; Part Description: General Purpose Thick Film Chip Resistor; Manufacturer: GENERIC; Manufacturer1 Part Number: 232270671003L; TC: ±100ppm/°C; Part Number: R0402_10K_1%_0.0625W_100PPM; Component Kind: Standard; Component Type: Standard; Pin Count: 2; Value: 10k; Status: Not recommended; Power: 0.0625W; Tolerance: ±1%; Manufacturer Part Number: R0402_10K_1%_0.0625W_100PPM; Case: 0402; Mounted: Yes; Sense: No; Socket: No; SMD: Yes; Manufacturer1 Example: YAGEO PHYCOMP; Manufacturer1 ComponentHeight: 0.4mm; HelpURL: \\cern.ch\dfs\Applications\Altium\Datasheets\R0402_Phycomp_RC0402.pdf; Author: CERN DEM JLC; CreateDate: 03.12.2007; LatestRevisionDate: 17.10.2012
R23 R74 = R0402_2K4_1%_0.0625W_100PPM: Resistor - 1%; Part Description: General Purpose Thick Film Chip Resistor; Manufacturer: GENERIC; Manufacturer1 Part Number: 232270672402L; TC: ±100ppm/°C; PressFit: No; Part Number: R0402_2K4_1%_0.0625W_100PPM; Component Kind: Standard; Component Type: Standard; Pin Count: 2; Value: 2k4; Status: Not Recommended; Power: 0.0625W; Tolerance: ±1%; Manufacturer Part Number: R0402_2K4_1%_0.0625W_100PPM; Case: 0402; Mounted: Yes; Sense: No; Socket: No; SMD: Yes; Manufacturer1 Example: YAGEO PHYCOMP; Manufacturer1 ComponentHeight: 0.4mm; HelpURL: \\cern.ch\dfs\Applications\Altium\Datasheets\R0402_Phycomp_RC0402.pdf; Author: CERN DEM JLC; CreateDate: 03.12.2007; LatestRevisionDate: 17.10.2012
R58 R59 R76-R78 R92 = R0603_220R_1%_0.1W_100PPM: Resistor - 1%; Part Description: General Purpose Thick Film Chip Resistor; Manufacturer: GENERIC; Manufacturer1 Part Number: NRC06F2200TRF; Power: 0.1W; TC: ±100ppm/°C; Part Number: R0603_220R_1%_0.1W_100PPM; Component Kind: Standard; Component Type: Standard; Pin Count: 2; Value: 220; Status: Preferred; Tolerance: ±1%; Manufacturer Part Number: R0603_220R_1%_0.1W_100PPM; Case: 0603; Mounted: Yes; Sense: No; Socket: No; SMD: Yes; Manufacturer1 Example: NIC COMPONENT; Manufacturer1 ComponentHeight: 0.55mm; HelpURL: \\cern.ch\dfs\Applications\Altium\Datasheets\R0603_NIC_NRC.pdf; Author: CERN DEM JLC; CreateDate: 03.12.2007; LatestRevisionDate: 13.03.2008
R70 R71 = R0603_82K_1%_0.1W_100PPM: Resistor - 1%; Part Description: General Purpose Thick Film Chip Resistor; Manufacturer: GENERIC; Manufacturer1 Part Number: NRC06F8202TRF; Power: 0.1W; TC: ±100ppm/°C; PressFit: No; Part Number: R0603_82K_1%_0.1W_100PPM; Component Kind: Standard; Component Type: Standard; Pin Count: 2; Value: 82k; Status: Preferred; Tolerance: ±1%; Manufacturer Part Number: R0603_82K_1%_0.1W_100PPM; Case: 0603; Mounted: Yes; Sense: No; Socket: No; SMD: Yes; Manufacturer1 Example: NIC COMPONENT; Manufacturer1 ComponentHeight: 0.55mm; HelpURL: \\cern.ch\dfs\Applications\Altium\Datasheets\R0603_NIC_NRC.pdf; Author: CERN DEM JLC; CreateDate: 03.12.2007; LatestRevisionDate: 13.03.2008
R209 R216 = R0402_100R_1%_0.0625W_100PPM: Resistor - 1%; Part Description: General Purpose Thick Film Chip Resistor; Manufacturer: GENERIC; Manufacturer1 Part Number: 232270671001L; TC: ±100ppm/°C; PressFit: No; Part Number: R0402_100R_1%_0.0625W_100PPM; Component Kind: Standard; Component Type: Standard; Pin Count: 2; Value: 100; Status: Not Recommended; Power: 0.0625W; Tolerance: ±1%; Manufacturer Part Number: R0402_100R_1%_0.0625W_100PPM; Case: 0402; Mounted: Yes; Sense: No; Socket: No; SMD: Yes; Manufacturer1 Example: YAGEO PHYCOMP; Manufacturer1 ComponentHeight: 0.4mm; HelpURL: \\cern.ch\dfs\Applications\Altium\Datasheets\R0402_Phycomp_RC0402.pdf; Author: CERN DEM JLC; CreateDate: 03.12.2007; LatestRevisionDate: 17.10.2012
R218 = R0402_10K_1%_0.0625W_100PPM: Resistor - 1%; Part Description: General Purpose Thick Film Chip Resistor; Manufacturer: GENERIC; Manufacturer1 Part Number: 232270671003L; TC: ±100ppm/°C; PressFit: No; Part Number: R0402_10K_1%_0.0625W_100PPM; Component Kind: Standard; Component Type: Standard; Pin Count: 2; Value: 10k; Status: Not Recommended; Power: 0.0625W; Tolerance: ±1%; Manufacturer Part Number: R0402_10K_1%_0.0625W_100PPM; Case: 0402; Mounted: Yes; Sense: No; Socket: No; SMD: Yes; Manufacturer1 Example: YAGEO PHYCOMP; Manufacturer1 ComponentHeight: 0.4mm; HelpURL: \\cern.ch\dfs\Applications\Altium\Datasheets\R0402_Phycomp_RC0402.pdf; Author: CERN DEM JLC; CreateDate: 03.12.2007; LatestRevisionDate: 17.10.2012
ST2 = SCHROFF_PANEL_3U_4HP_Stabilizer: Schroff 3HP 4U EUROCARD Panel; Manufacturer Part Number: 20818-017; Manufacturer: Schroff
T1-T4 = BSS138LT1G: N-CHANNEL MOSFET WITH DIODE; Part Description: 50V 200mA N-Channel Enhancement Mode Field-Effect Transistor; Manufacturer: ON SEMICONDUCTOR; PressFit: No; Bonding: No; Part Number: BSS138LT1G; Component Kind: Standard; Component Type: Standard; Device: BSS138LT1G; PackageDescription: SOT23 3-Leads, Pitch 0.95mm - Body 1.4x3mm, IPC Medium Density; Manufacturer Part Number: BSS138LT1G; Pin Count: 3; Case: SOT23-3; Mounted: Yes; Socket: No; SMD: Yes; Sense: No; ComponentHeight: 1.11mm; HelpURL: \\cern.ch\dfs\Applications\Altium\Datasheets\BSS138LT1G.pdf; Author: CERN DEM JLC; CreateDate: 23.03.2009; LatestRevisionDate: 23.03.2009
TP6 TP14 TP15 TP20 = SMD_PAD_1.27X1.27MM: Part Description: 1.27mm x 1.27mm PCB Copper Area (SMD Test Point); Mounted: No; Part Number: SMD_PAD_1.27X1.27MM; Component Kind: Standard (No BOM); Component Type: Standard (No BOM); Pin Count: 1; Family: Test Point; Socket: No; SMD: Yes; Sense: No; Status: None; ComponentHeight: 0mm; HelpURL: Undefined; Author: CERN DEM JLC; CreateDate: 12.01.2008; LatestRevisionDate: 12.01.2008; PackageDescription: 1.27mm x 1.27mm PCB Copper Area (SMD Test Point)
W1 = SAMTEC_HTSW-104-23-L-S: 4 Mini Wire-Wrap Contact Strip Header; Part Description: 4 Contacts, Pitch 2.54mm, Single Row  Through Mount Straight Header (Post Lead 5.84mm, Tail Lead 2.92mm, Insulator 2.54mm); Manufacturer: SAMTEC; PressFit: No; Status Comment: High Temperature; Part Number: SAMTEC_HTSW-104-23-L-S; Component Kind: Standard; Component Type: Standard; Pin Count: 4; Family: Header 4; Mounted: Yes; Socket: No; Sense: No; SMD: No; Status: Preferred; Manufacturer Part Number: HTSW-104-23-L-S; ComponentHeight: 8.38mm; HelpURL: \\cern.ch\dfs\Applications\Altium\Datasheets\SAMTEC_HTSW-104-23-L-S.pdf; Author: CERN DEM JLC; CreateDate: 22/02/2018; LatestRevisionDate: 22/02/2018
WASHER2 WASHER4 WASHER6 WASHER8 = Keystone_7687: SMA_Shoulder Washer; Part Description: Polyphenylene Sulfide PPS Shoulder Washer; PressFit: No; Part Number: custom 3D printed; Component Kind: Standard; Component Type: Mechanical; Footprint: custom 3D printed; Pin Count: 0; PackageDescription: custom 3D printed; Mounted: Yes; Socket: No; SMD: No; Sense: No; Status: None; Value: custom 3D printed; Manufacturer: custom; Manufacturer Part Number: custom 3D printed; ComponentHeight: 1.91mm; HelpURL: \\cern.ch\dfs\Applications\Altium\Datasheets\AAVID-THERMALLOY_7721-7PPSG.pdf; Author: GK; CreateDate: 28.01.2016; LatestRevisionDate: 28.01.2016

## Sheet Supply_Stabilizer.SchDoc: Stabilizer
size 420 x 297 mm; EDA_Number: ARTIQ; Projet: Stabilizer; Author: G.Kasprowicz; CompanyName: WUT ISE; DrawnBy: G.Kasprowicz; Organization: WUT ISE; Address1: PW ISE; Address2: Nowowiejska 15/19 00-665 Warsaw; Address3: gkasprow@gmail.com; DocumentNumber: 2; Revision: 3.4; SheetNumber: 2; SheetTotal: 11; ModifiedBy: -; CheckedDate: -; Title2: Power supply; DivGrp: WUT ISE; Designer: G.Kasprowicz; ModifiedDate: -; ProjectName: Sensor Box
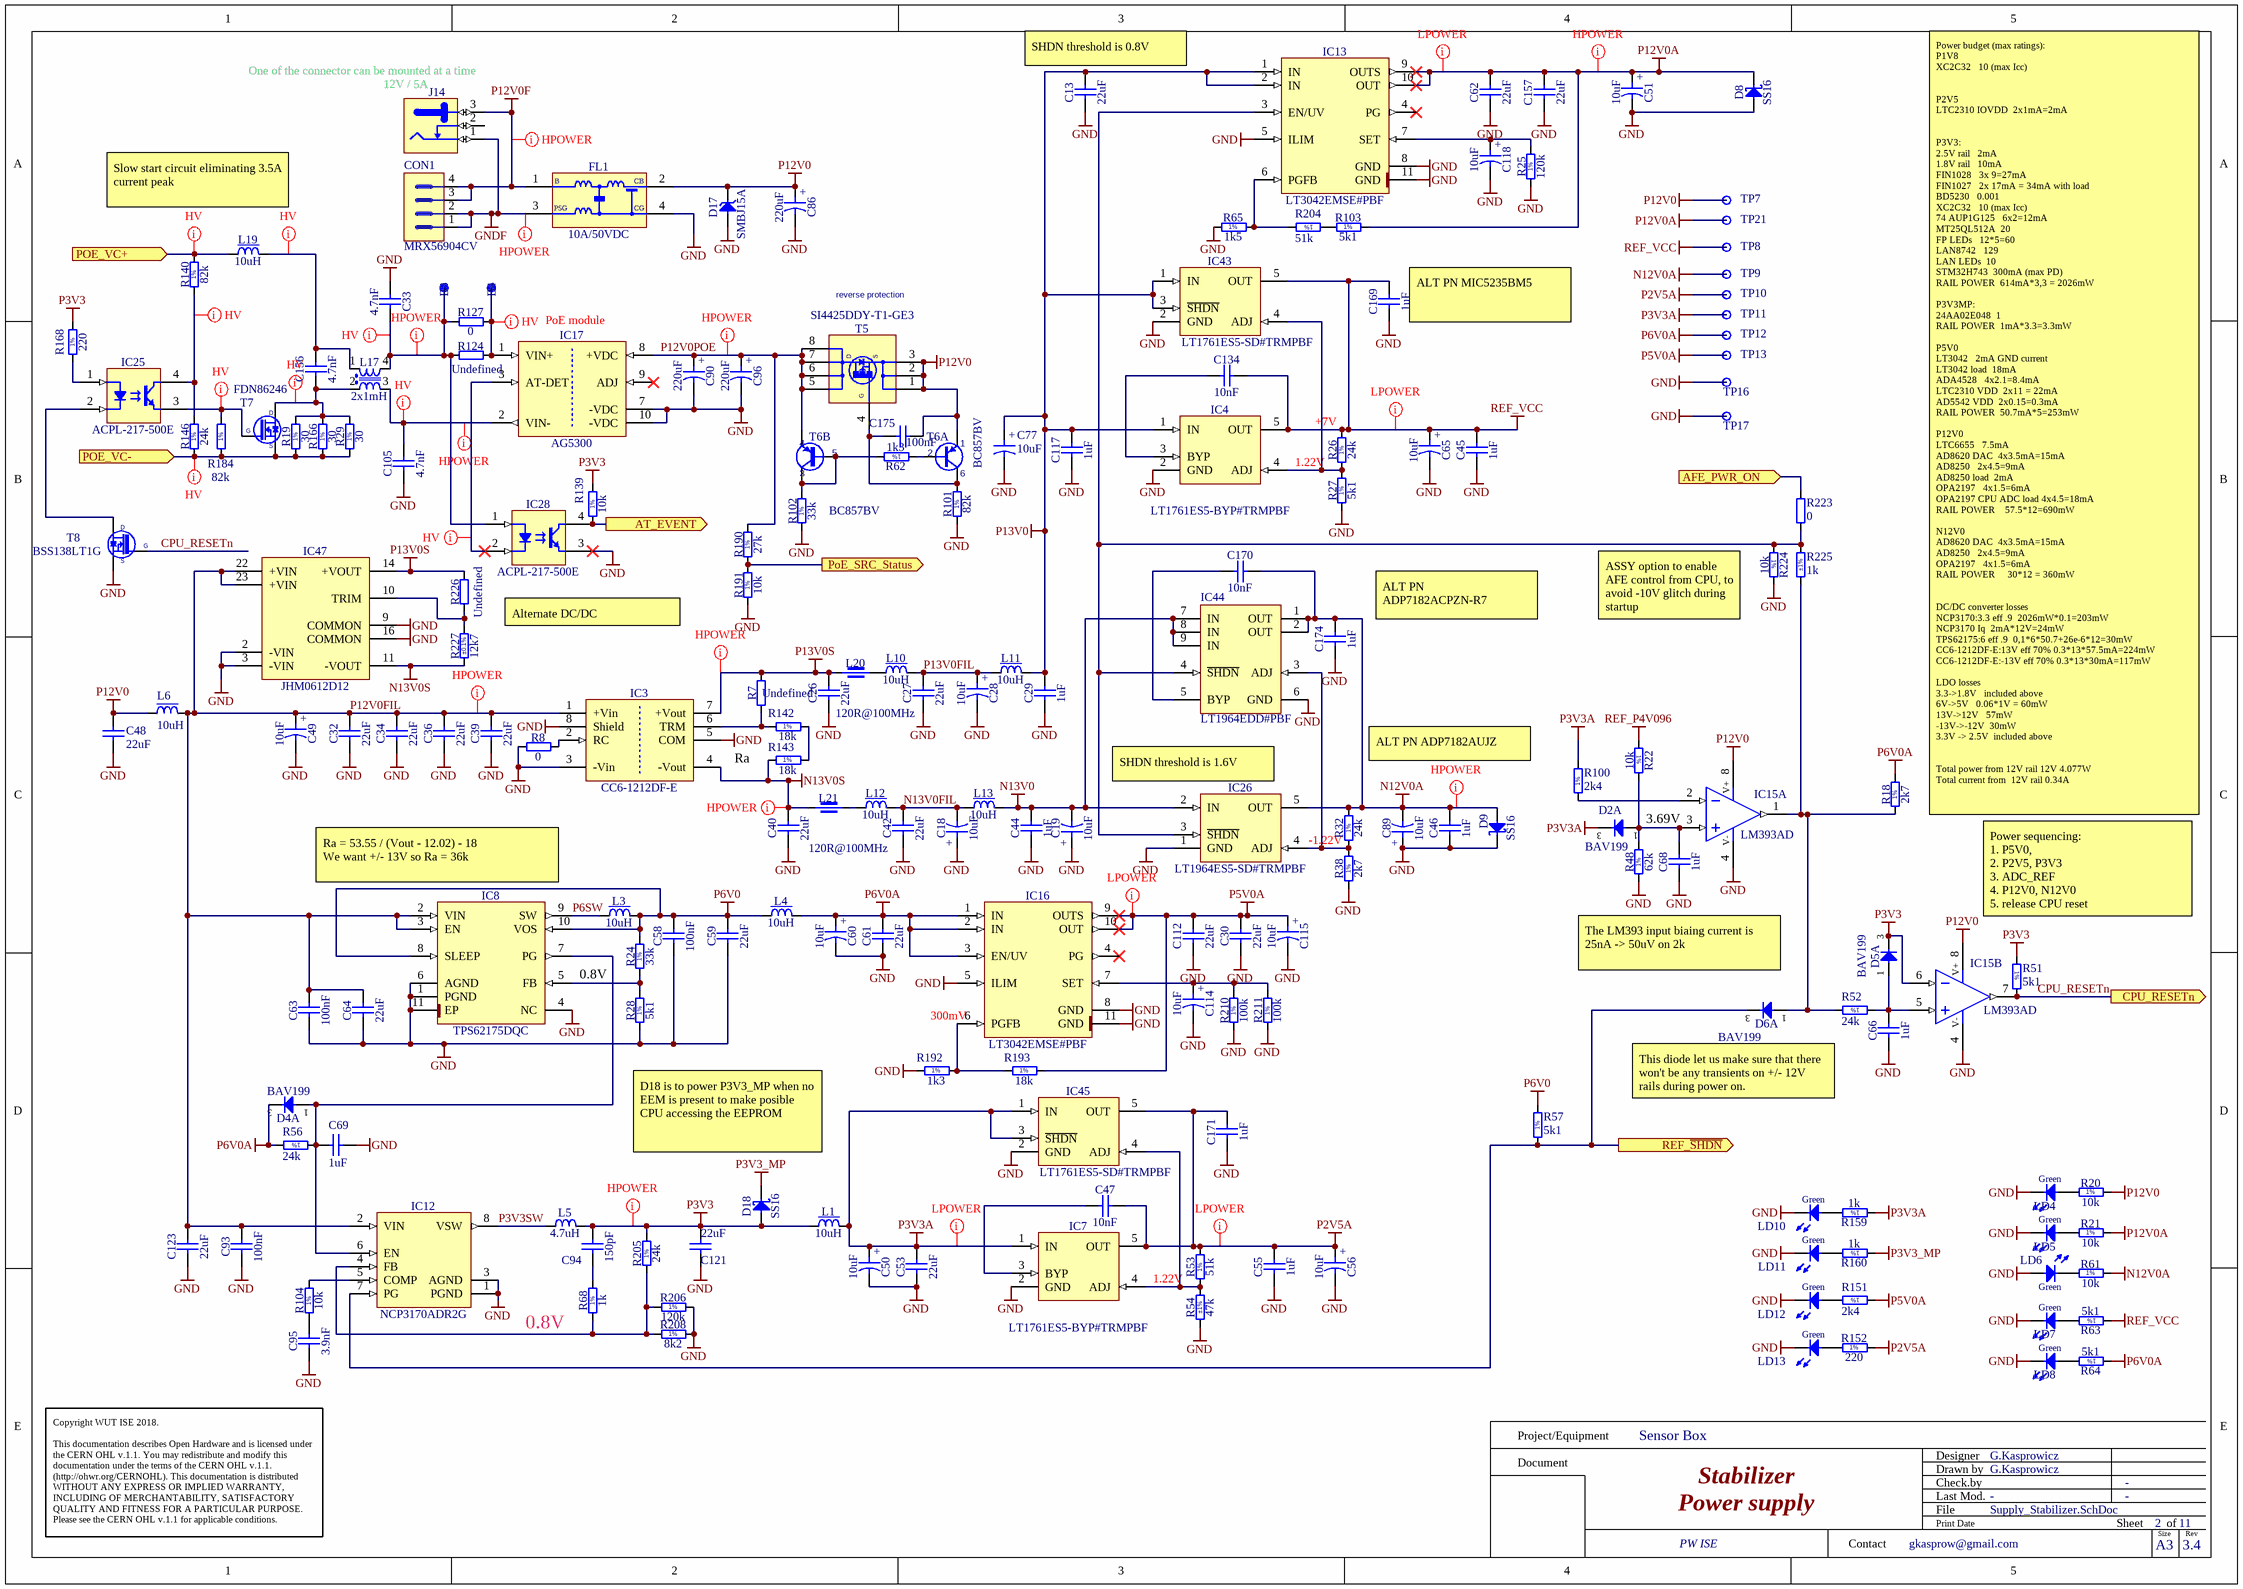
[diagram p1: Supply_Stabilizer.SchDoc]

### Parts
B3  SMD Pad  [C100]  (value not drawn)
B4  SMD Pad  [C100]  (value not drawn)
C13  22uF  [CAPC2012X135N]
C18  10uF  [CAPMP3216X180N]
C19  10uF  [CAPMP3216X180N]
C26  22uF  [CAPC2012X135N]
C27  22uF  [CAPC2012X135N]
C28  10uF  [CAPMP3216X180N]
C29  1uF  [CAPC1608X87N]
C30  22uF  [CAPC2012X135N]
C32  22uF  [CAPC2012X135N]
C33  4.7nF  [CAPC3216X140N]
C34  22uF  [CAPC2012X135N]
C36  22uF  [CAPC2012X135N]
C39  22uF  [CAPC2012X135N]
C40  22uF  [CAPC2012X135N]
C42  22uF  [CAPC2012X135N]
C44  1uF  [CAPC1608X87N]
C45  1uF  [CAPC1608X87N]
C46  1uF  [CAPC1608X87N]
C47  10nF  [CAPC1608X87N]
C48  22uF  [CAPC2012X135N]
C49  10uF  [CAPMP3216X180N]
C50  10uF  [CAPMP3216X180N]
C51  10uF  [CAPMP3216X180N]
C53  22uF  [CAPC2012X135N]
C55  1uF  [CAPC1608X87N]
C56  10uF  [CAPMP3216X180N]
C58  100nF  [CAPC1005X55N]
C59  22uF  [CAPC2012X135N]
C60  10uF  [CAPMP3216X180N]
C61  22uF  [CAPC2012X135N]
C62  22uF  [CAPC2012X135N]
C63  100nF  [CAPC1005X55N]
C64  22uF  [CAPC2012X135N]
C65  10uF  [CAPMP3216X180N]
C66  1uF  [CAPC1608X87N]
C68  1uF  [CAPC1608X87N]
C69  1uF  [CAPC1608X87N]
C77  10uF  [CAPMP3216X180N]
C86  220uF  [CAPAE830X620N]
C89  10uF  [CAPMP3216X180N]
C90  220uF  [CAPAE830X620N]
C93  100nF  [CAPC1005X55N]
C94  150pF  [CAPC1608X87N]
C95  3.9nF  [CAPC1608X87N]
C96  220uF  [CAPAE830X620N]
C105  4.7nF  [CAPC3216X140N]
C112  22uF  [CAPC2012X135N]
C114  10uF  [CAPMP3216X180N]
C115  10uF  [CAPMP3216X180N]
C117  1uF  [CAPC1608X87N]
C118  10uF  [CAPMP3216X180N]
C121  22uF  [CAPC2012X135N]
C123  22uF  [CAPC2012X135N]
C134  10nF  [CAPC1608X87N]
C156  4.7nF  [CAPC3216X140N]
C157  22uF  [CAPC2012X135N]
C169  1uF  [CAPC1608X87N]
C170  10nF  [CAPC1608X87N]
C171  1uF  [CAPC1608X87N]
C174  1uF  [CAPC1608X87N]
C175  100nF  [CAPC1608X87N]
CON1  MRX56904CV  [MRX56904CV]
D2  BAV199  [SOT95P240X110-3N]  (part A of 2)
D4  BAV199  [SOT95P240X110-3N]  (part A of 2)
D5  BAV199  [SOT95P240X110-3N]  (part A of 2)
D6  BAV199  [SOT95P240X110-3N]  (part A of 2)
D8  SS16  [DIOM5127X229N]
D9  SS16  [DIOM5127X229N]
D17  SMBJ15A  [DIOM5336X265N]
D18  SS16  [DIOM5127X229N]
FL1  10A/50VDC  [FIL_MURATA_BNX02]
IC3  CC6-1212DF-E  [CC6-1212DF-E]
IC4  LT1761ES5-BYP#TRMPBF  [SOT95P280X100-5N]
IC7  LT1761ES5-BYP#TRMPBF  [SOT95P280X100-5N]
IC8  TPS62175DQC  [SON50P200X300X80-11N-R94X250]
IC12  NCP3170ADR2G  [SOIC127P600X175-8N]
IC13  LT3042EMSE#PBF  [SOP50P490X110-11N-R168X198]
IC15  LM393AD  [SOIC127P600X175-8N]  (parts A,B of 2)
IC16  LT3042EMSE#PBF  [SOP50P490X110-11N-R168X198]
IC17  AG5300  [SILVERTEL_AG5300]
IC25  ACPL-217-500E  [SOIC127P700X242-4N]
IC26  LT1964ES5-SD#TRMPBF  [SOT95P280X100-5N]
IC28  ACPL-217-500E  [SOIC127P700X242-4N]
IC43  LT1761ES5-SD#TRMPBF  [SOT95P280X100-5N]
IC44  LT1964EDD#PBF  [LT-DD-8_V]
IC45  LT1761ES5-SD#TRMPBF  [SOT95P280X100-5N]
IC47  JHM0612D12  [DCDC_XPPOWER_JHM0X]
J14  Jack  [SWITCHCRAFT_L712RA]  (value not drawn)
L1  10uH  [IND_MURATA-PS_8400]
L3  10uH  [IND_MURATA-PS_8400]
L4  10uH  [IND_MURATA-PS_8400]
L5  4.7uH  [IND_BOURNS_SRU8043]
L6  10uH  [IND_MURATA-PS_8400]
L10  10uH  [IND_MURATA-PS_8400]
L11  10uH  [IND_MURATA-PS_8400]
L12  10uH  [IND_MURATA-PS_8400]
L13  10uH  [IND_MURATA-PS_8400]
L17  2x1mH  [IND_WURTH_WE-SL2]
L19  10uH  [IND_MURATA-PS_8400]
L20  120R@100MHz  [INDC1608X95N]
L21  120R@100MHz  [INDC1608X95N]
LD4  Green  [LED_KINGBRIGHT_KPH-1608CGCK]
LD5  Green  [LED_KINGBRIGHT_KPH-1608CGCK]
LD6  Green  [LED_KINGBRIGHT_KPH-1608CGCK]
LD7  Green  [LED_KINGBRIGHT_KPH-1608CGCK]
LD8  Green  [LED_KINGBRIGHT_KPH-1608CGCK]
LD10  Green  [LED_KINGBRIGHT_KPH-1608CGCK]
LD11  Green  [LED_KINGBRIGHT_KPH-1608CGCK]
LD12  Green  [LED_KINGBRIGHT_KPH-1608CGCK]
LD13  Green  [LED_KINGBRIGHT_KPH-1608CGCK]
R7  Undefined  [RESC1608X55N]
R8  0  [RESC1005X40N]
R18  2k7  [RESC1608X55N]
R19  30  [RESC1608X55N]
R20  10k  [RESC1005X40N]
R21  10k  [RESC1005X40N]
R22  10k  [RESC1005X40N]
R24  33k  [RESC1005X40N]
R25  120k  [RESC1608X55N]
R26  24k  [RESC1608X55N]
R27  5k1  [RESC1005X40N]
R28  5k1  [RESC1005X40N]
R29  30  [RESC1608X55N]
R32  24k  [RESC1608X55N]
R38  2k7  [RESC1608X55N]
R48  62k  [RESC1005X40N]
R51  5k1  [RESC1005X40N]
R52  24k  [RESC1608X55N]
R53  51k  [RESC1005X40N]
R54  47k  Tolerance: ±1%  [RESC1005X40N]
R56  24k  [RESC1608X55N]
R57  5k1  [RESC1005X40N]
R61  10k  [RESC1005X40N]
R62  1k3  [RESC1608X55N]
R63  5k1  [RESC1005X40N]
R64  5k1  [RESC1005X40N]
R65  1k5  [RESC1005X40N]
R68  1k  [RESC1608X55N]
R100  2k4  [RESC1005X40N]
R101  82k  [RESC1608X55N]
R102  33k  [RESC1005X40N]
R103  5k1  [RESC1005X40N]
R104  10k  [RESC1005X40N]
R124  Undefined  [RESC2012X60N]
R127  0  [RESC1005X40N]
R139  10k  [RESC1005X40N]
R140  82k  [RESC1608X55N]
R142  18k  [RESC1005X40N]
R143  18k  [RESC1005X40N]
R146  24k  [RESC1608X55N]
R151  2k4  [RESC1005X40N]
R152  220  [RESC1608X55N]
R159  1k  [RESC1608X55N]
R160  1k  [RESC1608X55N]
R166  30  [RESC1608X55N]
R168  220  [RESC1608X55N]
R184  82k  [RESC1608X55N]
R190  27k  [RESC1005X40N]
R191  10k  [RESC1005X40N]
R192  1k3  [RESC1608X55N]
R193  18k  [RESC1005X40N]
R204  51k  [RESC1005X40N]
R205  24k  [RESC1608X55N]
R206  120k  [RESC1608X55N]
R208  8k2  [RESC1005X40N]
R210  100k  [RESC1608X55N]
R211  100k  [RESC1608X55N]
R223  0  [RESC1005X40N]
R224  10k  [RESC1005X40N]
R225  1k  Tolerance: ±1%  [RESC1608X55N]
R226  Undefined  [RESC1608X55N]
R227  12k7  Tolerance: ±0.1%  [RESC1608X55N]
T5  SI4425DDY-T1-GE3  [SOIC127P600X175-8N]
T6  BC857BV  [SOTFL50P160X60-6N]  (parts A,B of 2)
T7  FDN86246  [SOT95P237X112-3N]
T8  BSS138LT1G  [SOT95P240X110-3N]
TP7  Test Point  [TPS127]  (value not drawn)
TP8  Test Point  [TPS127]  (value not drawn)
TP9  Test Point  [TPS127]  (value not drawn)
TP10  Test Point  [TPS127]  (value not drawn)
TP11  Test Point  [TPS127]  (value not drawn)
TP12  Test Point  [TPS127]  (value not drawn)
TP13  Test Point  [TPS127]  (value not drawn)
TP16  Test Point  [TPS127]  (value not drawn)
TP17  Test Point  [TPS127]  (value not drawn)
TP21  Test Point  [TPS127]  (value not drawn)

### Ports
AFE_PWR_ON (in), AT_EVENT (out), CPU_RESETn (out), PoE_SRC_Status (out), POE_VC+ (in), POE_VC- (in), REF_~{SHDN} (out)

### Nets
GND: C13.1 C18.1 C19.1 C26.1 C27.1 C28.2 C29.1 C30.1 C32.1 C33.1 C34.1 C36.1 C39.1 C40.1 C42.1 C44.1 C45.1 C46.1 C48.1 C49.2 C50.2 C51.2 C53.1 C55.1 C56.2 C58.1 C59.1 C60.2 C61.1 C62.1 C63.1 C64.1 C65.2 C66.1 C68.1 C69.1 C77.2 C86.2 C89.1 C90.2 C93.1 C95.1 C96.2 C105.1 C112.1 C114.2 C115.2 C117.1 C118.2 C121.1 C123.1 C157.1 C169.1 C171.1 C174.1 D8.2(A) D9.1(C) D17.2(A) FL1.4(CG) IC3.3(-Vin) IC3.5(COM) IC3.8(Shield) IC4.2(GND) IC7.2(GND) IC8.1(PGND) IC8.4(NC) IC8.6(AGND) IC8.11(EP) IC12.1(PGND) IC12.3(AGND) IC13.5(ILIM) IC13.8(GND) IC13.11(GND) IC15.4(V-) IC16.5(ILIM) IC16.8(GND) IC16.11(GND) IC17.7(-VDC) IC17.10(-VDC) IC26.1(GND) IC28.3(E) IC43.2(GND) IC44.6(GND) IC45.2(GND) IC47.2(-VIN) IC47.3(-VIN) IC47.9(COMMON) IC47.16(COMMON) LD4.1(C) LD5.1(C) LD6.2(A) LD7.1(C) LD8.1(C) LD10.1(C) LD11.1(C) LD12.1(C) LD13.1(C) R8.1 R25.1 R27.1 R28.1 R38.1 R48.1 R54.1 R65.1 R101.1 R102.1 R191.1 R192.1 R206.2 R208.2 R210.1 R211.1 R224.2 T8.2(S) TP16.1 TP17.1
GNDF: CON1.1 CON1.2 FL1.3(PSG) J14.1
N12V0A: C46.2 C89.2 C170.2 C174.2 D9.2(A) IC26.5(OUT) IC44.1(OUT) IC44.2(OUT) R32.2 R61.2 TP9.1
N13V0: C19.2 C44.2 IC26.2(IN) IC44.7(IN) IC44.8(IN) IC44.9(IN) L13.2
N13V0S: C40.2 IC3.4(-Vout) IC47.11(-VOUT) L21.1 R143.1 R227.1
P2V5A: C47.2 C55.2 C56.1 C171.2 IC7.5(OUT) IC45.5(OUT) R53.2 R152.2 TP10.1
P3V3: C94.2 C121.2 D5.3(COMAC) D18.2(A) IC15.6(IN-) L1.1 L5.2 R51.1 R139.2 R168.2 R205.2
P3V3_MP: D18.1(C) R160.1
P3V3A: C50.1 C53.2 D2.3(COMAC) IC7.1(IN) IC45.1(IN) IC45.3(~{SHDN}) L1.2 R100.2 R159.1 TP11.1
P5V0A: C30.2 C112.2 C115.1 IC16.9(OUTS) IC16.10(OUT) R151.1 R193.2 TP13.1
P6V0: C58.2 C59.2 IC8.8(SLEEP) IC8.10(VOS) L3.2 L4.1 R24.2 R57.2
P6V0A: C60.1 C61.2 D4.3(COMAC) IC16.1(IN) IC16.2(IN) IC16.3(EN/UV) L4.2 R18.2 R56.2 R64.1 TP12.1
P12V0: C48.2 C86.1 C175.2 D17.1(C) FL1.2(CB) IC15.8(V+) L6.1 R20.2 T5.1(S) T5.2(S) T5.3(S) T6.1(E) TP7.1
P12V0A: C51.1 C62.2 C157.2 D8.1(C) IC13.9(OUTS) IC13.10(OUT) R21.2 R103.2 TP21.1
P12V0F: CON1.3 CON1.4 FL1.1(B) J14.3
P13V0: C13.2 C29.2 C77.1 C117.2 IC4.1(IN) IC13.1(IN) IC13.2(IN) IC43.1(IN) IC43.3(~{SHDN}) L11.2
P13V0S: C26.2 IC3.7(+Vout) IC47.14(+VOUT) L20.1 R7.2 R226.2
REF_P4V096: R22.1
REF_VCC: C45.2 C65.1 C134.2 C169.2 IC4.5(OUT) IC43.5(OUT) R26.2 R63.1 TP8.1
AFE_PWR_ON: R223.1 ; port AFE_PWR_ON
AT_EVENT: IC28.4(C) R139.1 ; port AT_EVENT
CPU_RESETn: IC15.7(OUT) R51.2 T8.1(G) ; port CPU_RESETn
N13V0FIL: C18.2 C42.2 L12.2 L13.1
P3V3SW: IC12.8(VSW) L5.1
P6SW: IC8.9(SW) L3.1
P12V0FIL: C32.2 C34.2 C36.2 C39.2 C49.1 C63.2 C64.2 C93.2 C123.2 IC3.1(+Vin) IC8.2(VIN) IC8.3(EN) IC12.2(VIN) IC47.22(+VIN) IC47.23(+VIN) L6.2
P12V0POE: C90.1 C96.1 IC17.8(+VDC) R190.2 T5.5(D) T5.6(D) T5.7(D) T5.8(D) T6.4(E)
P13V0FIL: C27.2 C28.1 L10.2 L11.1
PoE_SRC_Status: R190.1 R191.2 ; port PoE_SRC_Status
POE_VC+: L19.1 R140.2 ; port POE_VC+
POE_VC-: R19.1 R29.1 R146.1 R166.1 R184.1 T7.2(S) ; port POE_VC-
REF_~{SHDN}: D6.3(COMAC) IC12.7(PG) R57.1 ; port REF_~{SHDN}
NetB3_1: B3.1 C33.2 IC28.1(A) L17.4 R124.1 R127.1
NetB4_1: B4.1 IC17.1(VIN+) R124.2 R127.2
NetC47_1: C47.1 IC7.3(BYP)
NetC66_2: C66.2 D5.1(A) IC15.5(IN+) R52.1
NetC68_2: C68.2 D2.1(A) IC15.3(IN+) R22.2 R48.2
NetC69_2: C69.2 D4.1(A) IC8.7(PG) IC12.6(EN) R56.1
NetC94_1: C94.1 R68.2
NetC95_2: C95.2 R104.1
NetC105_2: C105.2 IC17.2(VIN-) L17.3
NetC114_1: C114.1 IC16.7(SET) R210.2 R211.2
NetC118_1: C118.1 IC13.7(SET) R25.2
NetC134_1: C134.1 IC4.3(BYP)
NetC156_1: C156.1 L17.2 R19.2 R29.2 R166.2 T7.3(D)
NetC156_2: C156.2 L17.1 L19.2
NetC170_1: C170.1 IC44.5(BYP)
NetC175_1: C175.1 R101.2 T5.4(S) T6.6(C)
NetD6_1: D6.1(A) IC15.1(OUT) R18.1 R52.2 R225.1
NetIC3_2: IC3.2(RC) R8.2
NetIC3_6: IC3.6(TRM) R7.1 R142.1
NetIC4_4: IC4.4(ADJ) IC43.4(ADJ) R26.1 R27.2
NetIC7_4: IC7.4(ADJ) IC45.4(ADJ) R53.1 R54.2
NetIC8_5: IC8.5(FB) R24.1 R28.2
NetIC12_4: IC12.4(FB) R68.1 R205.1 R206.1 R208.1
NetIC12_5: IC12.5(COMP) R104.2
NetIC13_3: IC13.3(EN/UV) IC26.3(~{SHDN}) IC44.4(~{SHDN}) R223.2 R224.1 R225.2
NetIC13_6: IC13.6(PGFB) R65.2 R204.2
NetIC15_2: IC15.2(IN-) R100.1
NetIC16_6: IC16.6(PGFB) R192.2 R193.1
NetIC17_3: IC17.3(AT-DET) IC28.2(C)
NetIC25_1: IC25.1(A) R168.1
NetIC25_2: IC25.2(C) T8.3(D)
NetIC25_3: IC25.3(E) R184.2 T7.1(G)
NetIC25_4: IC25.4(C) R140.1 R146.2
NetIC26_4: IC26.4(ADJ) IC44.3(ADJ) R32.1 R38.2
NetIC47_10: IC47.10(TRIM) R226.1 R227.2
NetL10_1: L10.1 L20.2
NetL12_1: L12.1 L21.2
NetLD4_2: LD4.2(A) R20.1
NetLD5_2: LD5.2(A) R21.1
NetLD6_1: LD6.1(C) R61.1
NetLD7_2: LD7.2(A) R63.2
NetLD8_2: LD8.2(A) R64.2
NetLD10_2: LD10.2(A) R159.2
NetLD11_2: LD11.2(A) R160.2
NetLD12_2: LD12.2(A) R151.2
NetLD13_2: LD13.2(A) R152.1
NetR62_1: R62.1 T6.2(B)
NetR62_2: R62.2 R102.2 T6.3(C) T6.5(B)
NetR103_1: R103.1 R204.1
NetR142_2: R142.2 R143.2

Not connected (* = marked no-connect by the designer): IC13 4(PG)*; IC16 4(PG)*; IC17 9(ADJ)*; J14 2

### Layout directives
net class Hpower; rule Routing Via Style [Pref Size = 0.7mm    Pref Hole Size = 0.5mm]; rule Width Constraint [Pref Width = 20mil    Min Width = 15mil    Max Width = 50mil]: GNDF, N12V0A, N13V0S, NetB3_1, NetC105_2, P3V3, P12V0A, P12V0F, P12V0FIL, P12V0POE, P13V0S
net class Lpower; rule Routing Via Style [Pref Size = 0.6mm    Pref Hole Size = 0.3mm]; rule Width Constraint [Pref Width = 15mil    Min Width = 10mil    Max Width = 20mil]: P2V5A, P3V3A, P5V0A, P12V0A, REF_VCC
net class HV: NetB3_1, NetB4_1, NetC105_2, NetC156_1, NetC156_2, NetIC17_3, NetIC25_3, NetIC25_4, POE_VC+, POE_VC-